# EAGLE schematic pc_healthypi_move_sensor_dual_v2 (EAGLE 9.6.2)
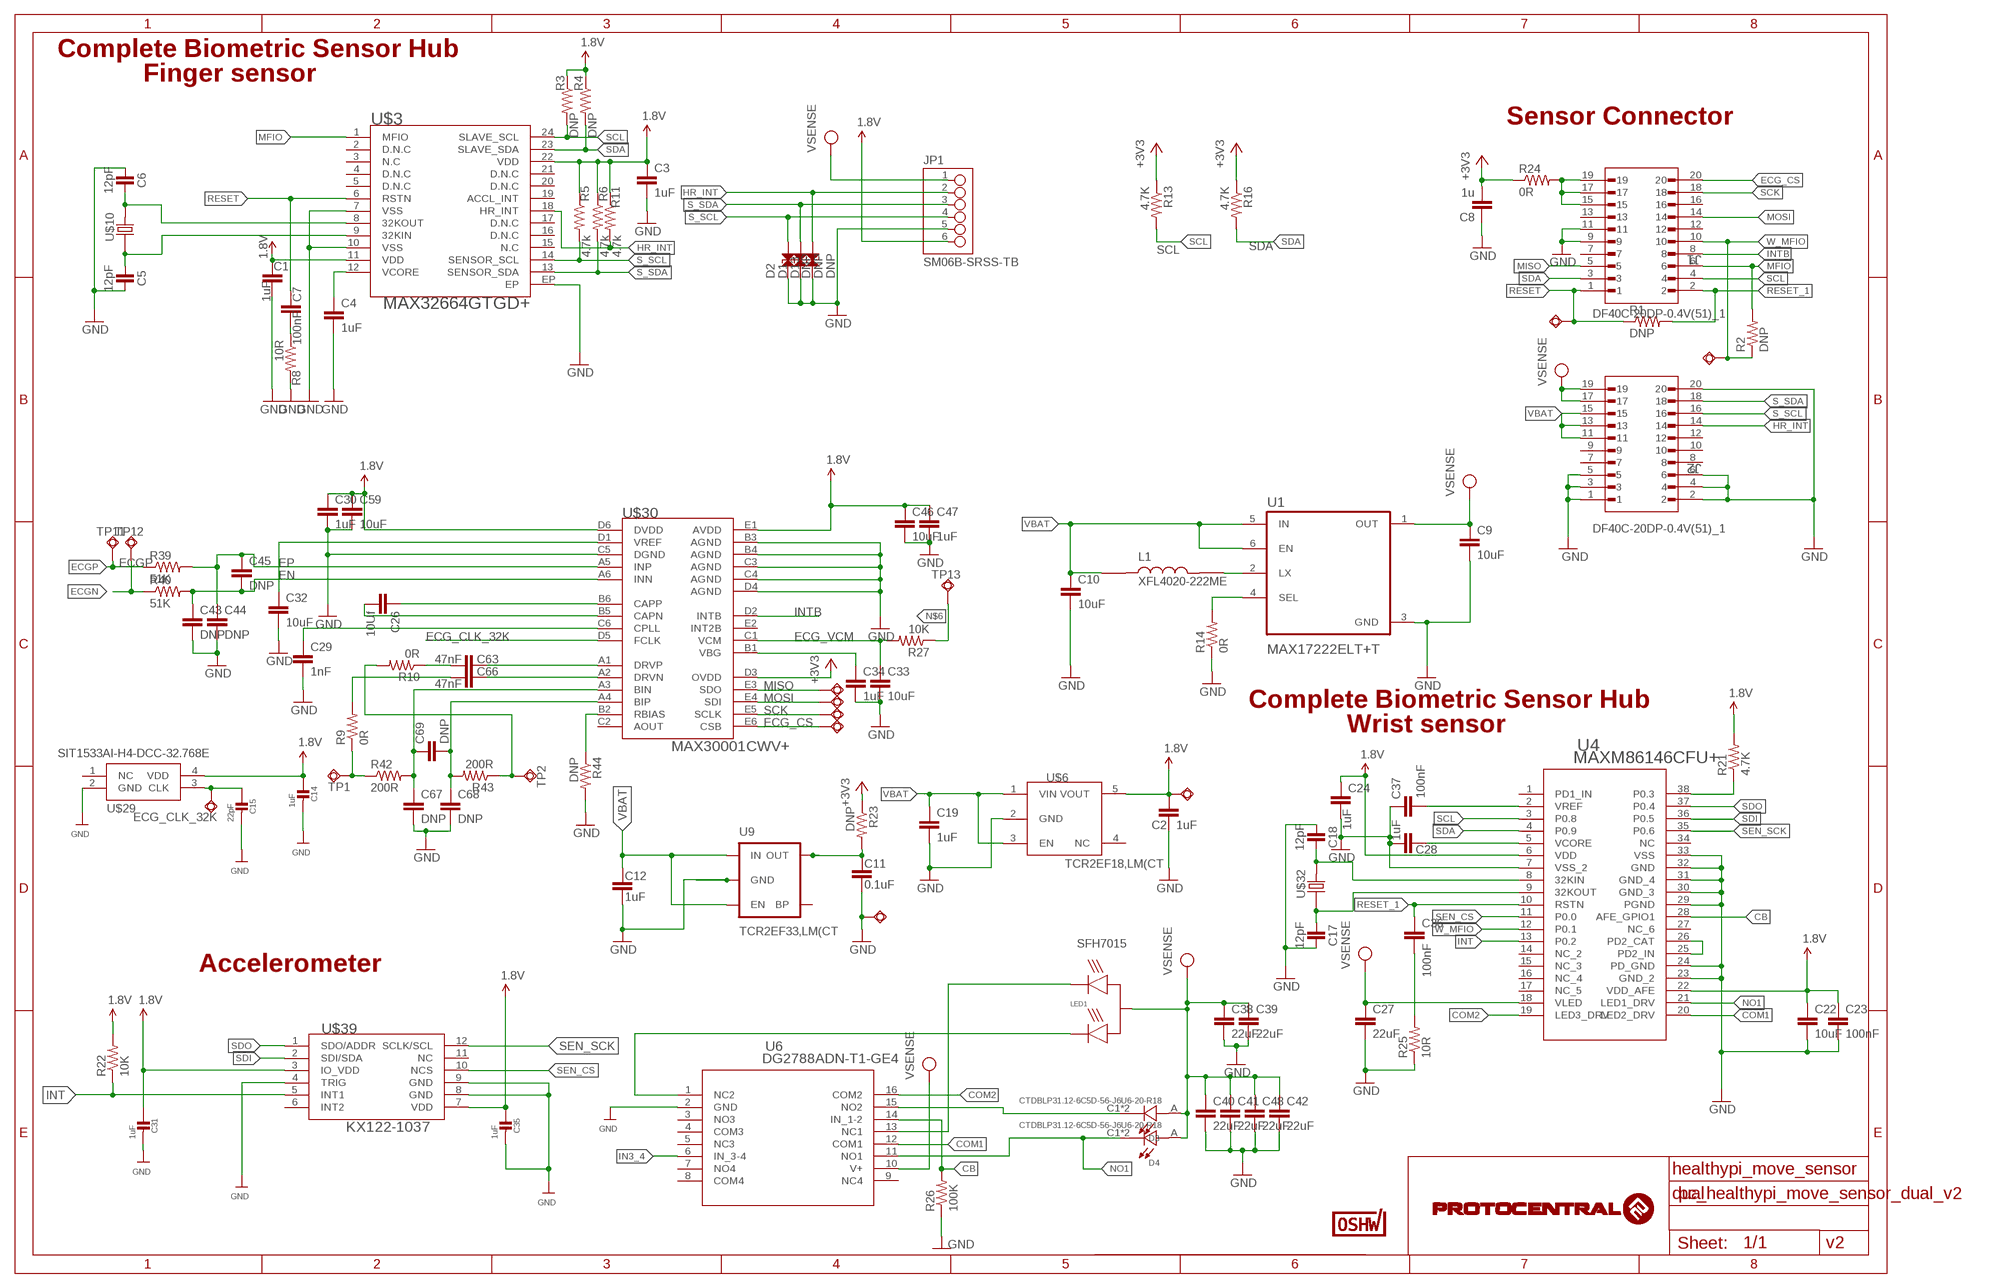
[diagram p0: schematic, sheet 1]

## Parts
C1  1uF  C-EUC0402  [C0402]
C2  1uF  C-EUC0402  [C0402]
C3  1uF  C-EUC0402  [C0402]
C4  1uF  C-EUC0402  [C0402]
C5  12pF  CAPACITORS-0402  [C0402]
C6  12pF  CAPACITORS-0402  [C0402]
C7  100nF  C-EUC0402  [C0402]
C8  1u  C-EUC0402  [C0402]
C9  10uF  C-EUC0402  [C0402]
C10  10uF  C-EUC0402  [C0402]
C11  0.1uF  0.1UF-0402-16V-10%  [0402]
C12  1uF  0.1UF-0402T-6.3V-10%-X7R  [0402-TIGHT]
C14  1uF  CAP_CERAMIC0402  [0402]
C15  22pF  CAP_CERAMIC0402  [0402]
C17  12pF  CAPACITORS-0402  [C0402]
C18  12pF  CAPACITORS-0402  [C0402]
C19  1uF  C-EUC0402  [C0402]
C22  10uF  C-EUC0402  [C0402]
C23  100nF  C-EUC0402  [C0402]
C24  1uF  C-EUC0402  [C0402]
C26  10Uf  C-EUC0402  [C0402]
C27  22uF  C-EUC0805  [C0805]
C28  1uF  C-EUC0402  [C0402]
C29  1nF  C-EUC0402  [C0402]
C30  1uF  C-EUC0402  [C0402]
C31  1uF  CAP_CERAMIC0402  [0402]
C32  10uF  C-EUC0402  [C0402]
C33  10uF  C-EUC0402  [C0402]
C34  1uF  C-EUC0402  [C0402]
C35  1uF  CAP_CERAMIC0402  [0402]
C36  100nF  C-EUC0402  [C0402]
C37  100nF  C-EUC0402  [C0402]
C38  22uF  C-EUC0805  [C0805]
C39  22uF  C-EUC0805  [C0805]
C40  22uF  C-EUC0805  [C0805]
C41  22uF  C-EUC0805  [C0805]
C42  22uF  C-EUC0805  [C0805]
C43  DNP  C-EUC0402  [C0402]
C44  DNP  C-EUC0402  [C0402]
C45  DNP  C-EUC0402  [C0402]
C46  10uF  C-EUC0402  [C0402]
C47  1uF  C-EUC0402  [C0402]
C48  22uF  C-EUC0805  [C0805]
C59  10uF  C-EUC0402  [C0402]
C63  47nF  C-EUC0402  [C0402]
C66  47nF  C-EUC0402  [C0402]
C67  DNP  C-EUC0402  [C0402]
C68  DNP  C-EUC0402  [C0402]
C69  DNP  C-EUC0402  [C0402]
D1  DNP  PESD0402-0402  [0402]
D2  DNP  PESD0402-0402  [0402]
D3  CTDBLP31.12-6C5D-56-J6U6-20-R18  [LED_CTDBLP31.12-6C5D-56-J6U6-20-R18]
D4  CTDBLP31.12-6C5D-56-J6U6-20-R18  [LED_CTDBLP31.12-6C5D-56-J6U6-20-R18]
D13  DNP  PESD0402-0402  [0402]
J1  DF40C-20DP-0.4V(51)_1  [HRS_DF40C-20DP-0.4V(51)]
J2  DF40C-20DP-0.4V(51)_1  [HRS_DF40C-20DP-0.4V(51)]
JP1  SM06B-SRSS-TB  [SM06B-SRSS-TB]
L1  XFL4020-222ME  [IND_XFL4020-222ME]
LED1  SFH7015  [SFH7015]
R1  DNP  RESISTOR0402-RES  [0402-RES]
R2  DNP  RESISTOR0402-RES  [0402-RES]
R3  DNP  RESISTOR0402-RES  [0402-RES]
R4  DNP  RESISTOR0402-RES  [0402-RES]
R5  4.7k  RESISTOR0402-RES  [0402-RES]
R6  4.7k  RESISTOR0402-RES  [0402-RES]
R8  10R  RESISTOR0402-RES  [0402-RES]
R9  0R  RESISTOR0402-RES  [0402-RES]
R10  0R  RESISTOR0402-RES  [0402-RES]
R11  4.7k  RESISTOR0402-RES  [0402-RES]
R13  4.7K  RESISTOR0402-RES  [0402-RES]
R14  0R  R-US_R0402  [R0402]
R16  4.7K  RESISTOR0402-RES  [0402-RES]
R21  4.7K  R-US_R0402  [R0402]
R22  10K  RESISTOR0402-RES  [0402-RES]
R23  DNP  RESISTOR0402-RES  [0402-RES]
R24  0R  RESISTOR0402-RES  [0402-RES]
R25  10R  R-US_R0402  [R0402]
R26  100K  R-US_R0402  [R0402]
R27  10K  R-US_R0402  [R0402]
R39  51K  RESISTOR0402-RES  [0402-RES]
R40  51K  RESISTOR0402-RES  [0402-RES]
R42  200R  RESISTOR0402-RES  [0402-RES]
R43  200R  RESISTOR0402-RES  [0402-RES]
R44  DNP  RESISTOR0402-RES  [0402-RES]
SWIO1  TPSQTP11R  [TP11R]
SWIO2  TPSQTP11R  [TP11R]
SWIO3  TPSQTP11R  [TP11R]
SWIO4  TPSQTP11R  [TP11R]
SWIO5  TPSQTP11R  [TP11R]
SWIO6  TPSQTP11R  [TP11R]
SWIO7  TPSQTP11R  [TP11R]
SWIO8  TPSQTP11R  [TP11R]
SWIO9  TPSQTP11R  [TP11R]
TP1  TPSQTP20SQ  [TP20SQ]
TP2  TPSQTP20SQ  [TP20SQ]
TP11  TPSQTP20SQ  [TP20SQ]
TP12  TPSQTP20SQ  [TP20SQ]
TP13  TPSQTP20SQ  [TP20SQ]
U1  MAX17222ELT+T  [SON65P200X200X80-6N]
U4  MAXM86146CFU+  [21-100323A_90-100112A_MXM]
U6  DG2788ADN-T1-GE4  [MINIQFN-16_VIS]
U9  TCR2EF33,LM(CT  V_REG_LDOSMD  [SOT23-5]
U$3  MAX32664GTGD+  MAX32664GTGA+  [TQFN-24L]
U$6  TCR2EF18,LM(CT  AP7354D-18W5-7  [SOT95P285X140-5N]
U$10  520-327-12.5-34B(32.768KHZ)  ECS-X-34B  [ECX-31B]
U$29  SIT1533AI-H4-DCC-32.768E  [SIT1533]
U$30  MAX30001CWV+  [30WLP]
U$32  520-327-12.5-34B(32.768KHZ)  ECS-X-34B  [ECX-31B]
U$39  KX122-1037  [KIONIX_KXTJ3-1057]
U$48  CERT-SMALL  [CERT-SMALL-SILK]

## Nets
1.8V: C1.1 C2.1 C3.1 C14.1 C22.1 C23.1 C24.1 C30.1 C31.1 C35.1 C46.1 C47.1 C59.1 JP1.6 R3.1 R4.1 R5.1 R6.1 R11.1 R21.2 R22.2 SWIO5.TP U4.6(VDD) U4.22(VDD_AFE) U$3.11(VDD) U$3.22(VDD) U$6.5(VOUT) U$29.4(VDD) U$30.D6(DVDD) U$30.E1(AVDD) U$39.3(IO_VDD) U$39.7(VDD)
+3V3: C8.2 R13.1 R16.1 R23.1 R24.1 U$30.D3(OVDD)
BIAZP: R10.2 R43.1 TP2.TP
BIOZN: R9.1 R42.1 TP1.TP
CB: R26.2 U4.28(AFE_GPIO1) U6.14(IN_1-2)
CLK_32K: C5.1 U$3.9(32KIN) U$10.P$1
CLK_32K1: C17.1 U4.9(32KOUT) U$32.P$1
COM1: U4.20(LED2_DRV) U6.12(COM1)
COM2: U4.19(LED3_DRV) U6.16(COM2)
ECG_CLK_32K: C15.1 SWIO1.TP U$29.3(CLK) U$30.D5(FCLK)
ECG_CS: J1.20 SWIO7.TP U$30.E6(CSB)
ECG_VCM: C33.1 R27.2 U$30.C1(VCM)
ECGN: R40.1 TP12.TP
ECGP: R39.1 TP11.TP
EN: C43.1 C45.2 R40.2 U$30.A6(INN)
EP: C44.1 C45.1 R39.2 U$30.A5(INP)
EXT_3V3: J1.15 J1.17 J1.19 R24.2
GND: C1.2 C2.2 C3.2 C4.2 C5.2 C6.1 C8.1 C9.2 C10.2 C11.2 C12.2 C14.2 C15.2 C17.2 C18.1 C19.2 C22.2 C23.2 C24.2 C27.2 C28.2 C29.2 C30.2 C31.2 C32.2 C33.2 C34.2 C35.2 C37.1 C38.2 C39.2 C40.2 C41.2 C42.2 C43.2 C44.2 C46.2 C47.2 C48.2 C59.2 C67.2 C68.2 D1.1 D2.1 D13.1 J1.9 J1.11 J2.1 J2.2 J2.3 J2.4 J2.5 J2.6 J2.20 JP1.5 R8.2 R14.1 R25.1 R26.1 R44.2 SWIO6.TP U1.3(GND) U4.7(VSS_2) U4.23(GND_2) U4.24(PD_GND) U4.29(PGND) U4.30(GND_3) U4.31(GND_4) U4.32(GND) U4.33(VSS) U6.2(GND) U9.2(GND) U$3.7(VSS) U$3.10(VSS) U$3.EP U$6.2(GND) U$29.2(GND) U$30.B3(AGND) U$30.B4(AGND) U$30.C3(AGND) U$30.C4(AGND) U$30.C5(DGND) U$30.D4(AGND) U$39.4(TRIG) U$39.8(GND) U$39.9(GND)
HR_INT: D13.2 J2.14 JP1.2 R11.2 U$3.18(HR_INT)
IN3_4: U6.6(IN_3-4)
INT: R22.1 U4.13(P0.2) U$39.5(INT1)
INT_3V3: C11.1 R23.2 U9.5(OUT)
INTB: J1.8 U$30.D2(INTB)
MFIO: J1.6 R2.2 U$3.1(MFIO)
MISO: J1.5 SWIO2.TP U$30.E3(SDO)
MOSI: J1.14 SWIO3.TP U$30.E4(SDI)
N$1: C4.1 U$3.12(VCORE)
N$2: C7.2 R8.1
N$3: R14.2 U1.4(SEL)
N$4: L1.2 U1.2(LX)
N$5: C18.2 U4.8(32KIN) U$32.P$2
N$6: R27.1 TP13.TP
N$8: U4.25(PD2_IN) U4.26(PD2_CAT)
N$9: C28.1 U4.5(VCORE)
N$10: R21.1 U4.38(P0.3)
N$11: C37.2 U4.2(VREF)
N$12: C36.2 R25.2
N$18: C66.1 R9.2
N$19: C63.1 R10.1
N$21: LED1.4(IRC) U6.13(NC1)
N$23: LED1.2(RC) U6.1(NC2)
N$25: C6.2 U$3.8(32KOUT) U$10.P$2
N$26: D3.C1(C) D3.C2(C) U6.15(NO2)
N$53: C29.1 U$30.C6(CPLL)
N$55: C26.2 U$30.B5(CAPN)
N$56: C32.1 U$30.D1(VREF)
N$57: C34.1 U$30.B1(VBG)
N$60: C26.1 U$30.B6(CAPP)
N$61: C63.2 U$30.A1(DRVP)
N$62: C66.2 U$30.A2(DRVN)
N$63: C67.1 C69.1 R42.2 U$30.A3(BIN)
N$64: C68.1 C69.2 R43.2 U$30.A4(BIP)
N$65: R44.1 U$30.B2(RBIAS)
NO1: D4.C1(C) D4.C2(C) U4.21(LED1_DRV) U6.11(NO1)
RESET: C7.1 J1.1 R1.1 SWIO8.TP U$3.6(RSTN)
RESET_1: C36.1 J1.2 R1.2 U4.10(RSTN)
S_SCL: D2.2 J2.16 JP1.4 R5.2 U$3.14(SENSOR_SCL)
S_SDA: D1.2 J2.18 JP1.3 R6.2 U$3.13(SENSOR_SDA)
SCK: J1.18 SWIO4.TP U$30.E5(SCLK)
SCL: J1.4 R3.2 R13.2 U4.3(P0.8) U$3.24(SLAVE_SCL)
SDA: J1.3 R4.2 R16.2 U4.4(P0.9) U$3.23(SLAVE_SDA)
SDI: U4.36(P0.5) U$39.2(SDI/SDA)
SDO: U4.37(P0.4) U$39.1(SDO/ADDR)
SEN_CS: U4.11(P0.0) U$39.10(NCS)
SEN_SCK: U4.35(P0.6) U$39.12(SCLK/SCL)
VBAT: C10.1 C12.1 C19.1 J2.11 J2.13 J2.15 L1.1 U1.5(IN) U1.6(EN) U9.1(IN) U9.3(EN) U$6.1(VIN) U$6.3(EN)
VPP: C9.1 C27.1 C38.1 C39.1 C40.1 C41.1 C42.1 C48.1 D3.A D4.A J2.17 J2.19 JP1.1 LED1.3(A) U1.1(OUT) U4.18(VLED) U6.10(V+) ; supply symbol labelled VSENSE
W_MFIO: J1.10 R2.1 SWIO9.TP U4.12(P0.1)
Unconnected: J1.7 J1.12 J1.13 J1.16 J2.7 J2.8 J2.9 J2.10 J2.12 U4.1(PD1_IN) U4.14(NC_2) U4.15(NC_3) U4.16(NC_4) U4.17(NC_5) U4.27(NC_6) U4.34(NC) U6.3(NO3) U6.4(COM3) U6.5(NC3) U6.7(NO4) U6.8(COM4) U6.9(NC4) U9.4(BP) U$3.2(D.N.C) U$3.3(N.C) U$3.4(D.N.C) U$3.5(D.N.C) U$3.15(N.C) U$3.16(D.N.C) U$3.17(D.N.C) U$3.19(ACCL_INT) U$3.20(D.N.C) U$3.21(D.N.C) U$6.4(NC) U$29.1(NC) U$30.C2(AOUT) U$30.E2(INT2B) U$39.6(INT2) U$39.11(NC)

## Notes on the sheet
- Complete Biometric Sensor Hub
- Finger sensor
- Sensor Connector
- Complete Biometric Sensor Hub
- Wrist sensor
- SFH7015
- Accelerometer
- healthypi_move_sensor
- dual
- v2

## Library data of the parts
C1-C4 C7-C10 C19 C22-C24 C26-C30 C32-C34 C36-C48 C59 C63 C66-C69 = rcl:C-EU: CAPACITOR, European symbol; SPICEPREFIX: C
C5 C6 C17 C18 = Arduino:CAPACITORS: Capacitors ...4.7uF @ 6.3V -> 0402 ...10uF @ 16V -> 0603 ...22uF @ 25V -> 0805
C11 = SparkFun-Capacitors:0.1UF: 0.1µF ceramic capacitors A capacitor is a passive two-terminal electrical component used to store electrical energy temporarily in an electric field.; PROD_ID: CAP-12416
C12 = SparkFun-Capacitors:0.1UF: 0.1µF ceramic capacitors A capacitor is a passive two-terminal electrical component used to store electrical energy temporarily in an electric field.; PROD_ID: CAP-14993; VALUE: 0.1uF
C14 C15 C31 C35 = microbuilder:CAP_CERAMIC: Ceramic Capacitors 0402 - 0402 Surface Mount Capacitors 16pF 50V 5% [Digikey: 445-4899-2-ND] 18pF 50V 5% [Digikey: 490-1281-2-ND] 22pF 50V 5% [Digikey: 490-1283-2-ND] 68pF 50V 5% [Digikey: 490-1289-2-ND] 0.1uF 10V 10% [Digikey: 490-1318-2-ND] 1.0uF 6.3V 10% [Digikey: 490-1320-2-ND] 0603 - 0603 Surface Mount Capacitors 16 pF 50V 5% [Digikey: 445-5051-2-ND] 22 pF 50V [Digikey: PCC220ACVTR-ND] 33 pF 50V 5% [Digikey: 490-1415-1-ND] 56pF 50V 5% [Digikey: 490-1421-1-ND] 220pF 50V 5% [Digikey: 445-1285-1-ND] 680 pF 50V 2200 pF 50V 5% C0G [Digikey: 445-1297-1-ND] 5600 pF 100V 5% X7R [Digikey: 478-3711-1-ND] 0.1 µF 25V 10% [Digikey: PCC2277TR-ND] 0.22 µF 16V 10% X7R [Digikey: 445-1318-1-ND] 1.0 µF 25V 10% [Digikey: 445-5146-2-ND] 0603 - RF Specific 3pF 250V +/-0.1pF RF [Digikey: 712-1347-1-ND] 18 pF 250V 5% [Digikey: 478-3505-1-ND or 712-1322-1-ND] 56 pF 250V 5% C0G RF [Digikey: 490-4867-1-ND] 68 pF 250V RF [Digikey: 490-4868-1-ND] 0805 - 0805 Surface Mount Capacitors 220 pF 250V 2% RF Ceramic Capacitor [Digikey: 712-1398-1-ND] 1000 pF 50V 2% NP0 Ceramic Capacitor [Digikey: 478-3760-1-ND] 0.1 µF 25V 10% Ceramic Capacitor [Digikey: PCC1828TR-ND] 1.0 µF 16V 10% Ceramic Capacitor[Digikey: 490-1691-2-ND] 10.0 µF 10V 10% Ceramic Capacitor[Digikey: 709-1228-1-ND] 10.0 uF 16V 10% Ceramic Capacitor [Digikey: 478-5165-2-ND] 47 uF 6.3V 20% Ceramic Capacitor [Digikey: 587-1779-1-ND or 399-5506-1-ND] 1206 - 1206 Surface Mount Capacitors 47uF 10V 20% Ceramic Capacitor [Digikey: 490-5528-1-ND or 399-5508-1-ND or 445-6010-1-ND]
D1 D2 D13 = SparkFun-DiscreteSemi:PESD0402: ESD protection diode PESD is used to protect a signal line from ESD.; DIGIKEY_PART: PESD0402-140CT-ND; MOUSE_PART: 650-PESD0402-140; PROD_ID: DIO-15359
D3 D4 = circuitects:CTDBLP31.12-6C5D-56-J6U6-20-R18: Standard LEDs - SMD Green 536nm Firefly E2218 Check availability <https://pricing.snapeda.com/parts/CT%20DBLP31.12-6C5D-56-J6U6-20-R18/OSRAM%20Opto%20Semiconductors/view-part?ref=eda>; AVAILABILITY: In Stock; DESCRIPTION: Standard LEDs - SMD Green 536nm Firefly E2218; MF: OSRAM Opto Semiconductors; MP: CT DBLP31.12-6C5D-56-J6U6-20-R18; PACKAGE: None; PRICE: None; PURCHASE-URL: https://pricing.snapeda.com/search/part/CT DBLP31.12-6C5D-56-J6U6-20-R18/?ref=eda
J1 J2 = circuitects:DF40C-20DP-0.4V(51)_1; MANUFACTURER: Hirose Electric; MAXIMUM_PACKAGE_HEIGHT: 1.29mm; PARTREV: 02/2020; STANDARD: Manufacturer Recommendations
JP1 = circuitects:SM06B-SRSS-TB: Check availability <https://pricing.snapeda.com/parts/SM06B-SRSS-TB/JST%20Sales/view-part?ref=eda>; AVAILABILITY: In Stock; CHECK_PRICES: https://www.snapeda.com/parts/SM06B-SRSS-TB/JST+Sales+America+Inc./view-part/?ref=eda; DESCRIPTION: Connector Header Surface Mount, Right Angle 6 position 0.039 (1.00mm); MF: JST Sales; MP: SM06B-SRSS-TB; PACKAGE: None; PRICE: None; PURCHASE-URL: https://www.snapeda.com/api/url_track_click_mouser/?unipart_id=555083&manufacturer=JST Sales&part_name=SM06B-SRSS-TB&search_term=sm06b-srss-tb; SNAPEDA_LINK: https://www.snapeda.com/parts/SM06B-SRSS-TB/JST+Sales+America+Inc./view-part/?ref=snap
L1 = circuitects:XFL4020-222ME: Power inductor, shielded, 20% tol, SMT, RoHS, halogen free Check availability <https://pricing.snapeda.com/parts/XFL4020-222ME/Coilcraft/view-part?ref=eda>; AVAILABILITY: In Stock; CHECK_PRICES: https://www.snapeda.com/parts/XFL4020-222ME/Coilcraft/view-part/?ref=eda; DESCRIPTION: Power inductor, shielded, 20% tol, SMT, RoHS, halogen free; MF: Coilcraft; MP: XFL4020-222ME; PACKAGE: None; PRICE: None; SNAPEDA_LINK: https://www.snapeda.com/parts/XFL4020-222ME/Coilcraft/view-part/?ref=snap
LED1 = circuitects:SFH7015: Check availability <https://pricing.snapeda.com/parts/SFH%207015/OSRAM%20Opto%20Semiconductors/view-part?ref=eda>; AVAILABILITY: In Stock; DESCRIPTION: Infrared (IR) Emitter 950nm 1.3V 60mA 1.65mW/sr @ 20mA 120° 4-SMD, No Lead; MF: OSRAM Opto Semiconductors; MP: SFH 7015; PACKAGE: None; PRICE: None; PURCHASE-URL: https://pricing.snapeda.com/search/part/SFH 7015/?ref=eda
R1-R6 R8-R11 R13 R16 R22-R24 R39 R40 R42-R44 = SparkFun:RESISTOR: Resistor Basic schematic elements and footprints for 0603, 1206, and PTH resistors.
R14 R21 R25-R27 = rcl:R-US_: RESISTOR, American symbol; SPICEPREFIX: R
SWIO1-SWIO9 TP1 TP2 TP11-TP13 = testpad:TPSQ: Test pad
U1 = circuitects:MAX17222ELT+T: Check availability <https://pricing.snapeda.com/parts/MAX17222ELT%2BT/Analog%20Devices/view-part?ref=eda>; AVAILABILITY: In Stock; CHECK_PRICES: https://www.snapeda.com/parts/MAX17222ELT+T/Analog+Devices/view-part/?ref=eda; DESCRIPTION: 400mV to 5.5V Input, nanoPower Synchronous Boost Converter with True Shutdown; MF: Analog Devices; MP: MAX17222ELT+T; PACKAGE: uDFN-6 Maxim; PRICE: None; PURCHASE-URL: https://www.snapeda.com/api/url_track_click_mouser/?unipart_id=2779660&manufacturer=Analog Devices&part_name=MAX17222ELT+T&search_term= max17222elt+t; SNAPEDA_LINK: https://www.snapeda.com/parts/MAX17222ELT+T/Analog+Devices/view-part/?ref=snap
U4 = circuitects:MAXM86146CFU+; COPYRIGHT: Copyright (C) 2023 Ultra Librarian. All rights reserved.; MANUFACTURER_PART_NUMBER: MAXM86146CFU+; MFR_NAME: Analog Devices / Maxim Integrated
U6 = circuitects:DG2788ADN-T1-GE4; COPYRIGHT: Copyright (C) 2023 Ultra Librarian. All rights reserved.; MANUFACTURER_PART_NUMBER: DG2788ADN-T1-GE4; MFR_NAME: Vishay
U9 = SparkFun-PowerIC:V_REG_LDO: Voltage Regulator LDO Standard 150mA LDO voltage regulator in SOT-23 layout. Micrel part MIC5205. BP (by-pass) pin is used to lower output noise with 470pF cap.; PROD_ID: VREG-12457
U$3 = circuitects:MAX32664GTGA+
U$6 = circuitects:AP7354D-18W5-7
U$10 U$32 = circuitects:ECS-X-34B
U$29 = circuitects:SIT1533AI-H4-DCC-32.768E
U$30 = circuitects:MAX30001CWV+
U$39 = KIONIX_KXTJ3-1057:KX122-1037
U$48 = OSHWA:CERT

## Net classes
2 Clock: width 0.089 mm, clearance 0.178 mm